# EAGLE schematic Franky (EAGLE 7.6.0)
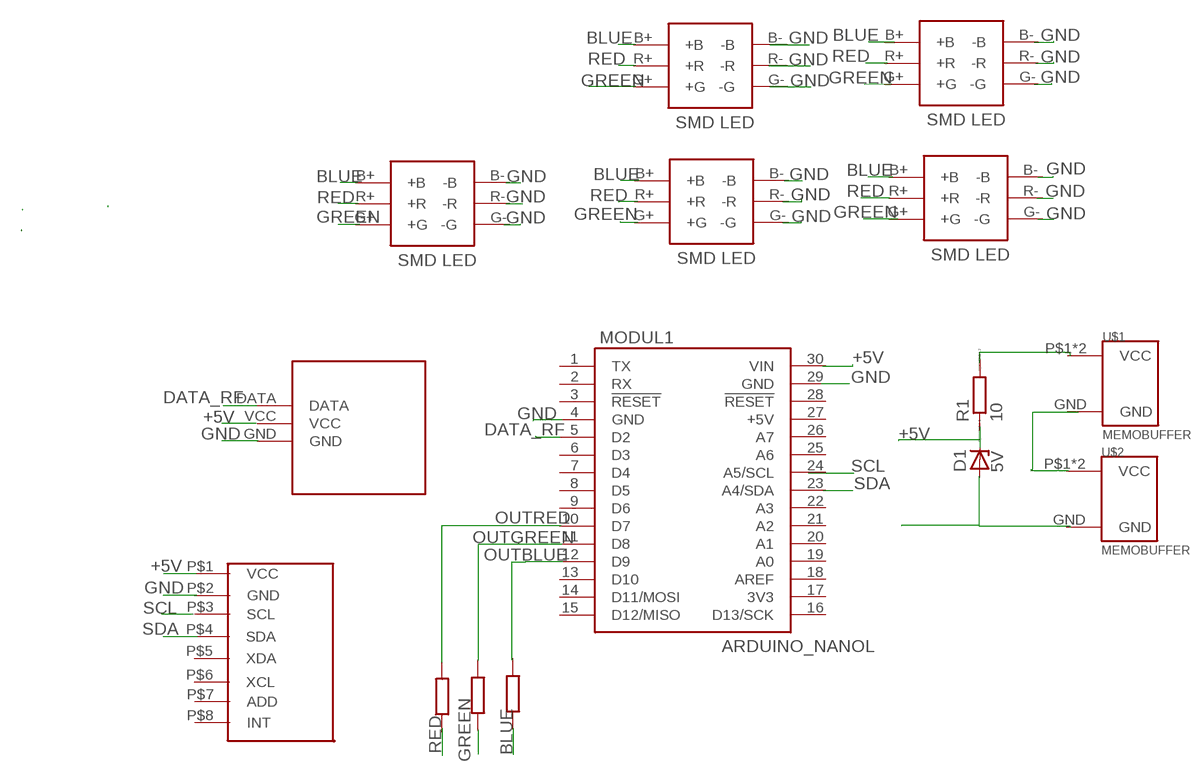
[diagram p0: schematic, sheet 1]

## Parts
D1  5V  1N4728  [DO41Z10]
GSENSOR  MPU-6050  [MPU-6050]
LED1  SMD_LED  [SMD_LED]
LED2  SMD_LED  [SMD_LED]
LED3  SMD_LED  [SMD_LED]
LED4  SMD_LED  [SMD_LED]
LED5  SMD_LED  [SMD_LED]
MODUL1  ARDUINO_NANOL  [ARDUINO_NANO_L]
R1  10  R  [R0805]
RFMODUL  AUKRU433_SENDER  [AUKRU433_SENDER]
U$1  MEMOBUFFER  [MEMOBUFFER]
U$2  MEMOBUFFER  [MEMOBUFFER]

## Nets
GND: LED3.B-(-B) LED3.G-(-G) LED3.R-(-R) LED4.B-(-B) LED4.G-(-G) LED4.R-(-R) LED5.B-(-B) LED5.G-(-G) LED5.R-(-R)
GREEN: LED3.G+(+G)
RED: LED3.R+(+R) LED4.R+(+R) LED5.R+(+R)
Unconnected: D1.A D1.C GSENSOR.P$1(VCC) GSENSOR.P$2(GND) GSENSOR.P$3(SCL) GSENSOR.P$4(SDA) GSENSOR.P$5(XDA) GSENSOR.P$6(XCL) GSENSOR.P$7(ADD) GSENSOR.P$8(INT) LED1.B+(+B) LED1.B-(-B) LED1.G+(+G) LED1.G-(-G) LED1.R+(+R) LED1.R-(-R) LED2.B+(+B) LED2.B-(-B) LED2.G+(+G) LED2.G-(-G) LED2.R+(+R) LED2.R-(-R) LED3.B+(+B) LED4.B+(+B) LED4.G+(+G) LED5.B+(+B) LED5.G+(+G) MODUL1.1(TX) MODUL1.2(RX) MODUL1.3(!RESET!) MODUL1.4(GND) MODUL1.5(D2) MODUL1.6(D3) MODUL1.7(D4) MODUL1.8(D5) MODUL1.9(D6) MODUL1.10(D7) MODUL1.11(D8) MODUL1.12(D9) MODUL1.13(D10) MODUL1.14(D11/MOSI) MODUL1.15(D12/MISO) MODUL1.16(D13/SCK) MODUL1.17(3V3) MODUL1.18(AREF) MODUL1.19(A0) MODUL1.20(A1) MODUL1.21(A2) MODUL1.22(A3) MODUL1.23(A4/SDA) MODUL1.24(A5/SCL) MODUL1.25(A6) MODUL1.26(A7) MODUL1.27(+5V) MODUL1.28(!RESET!) MODUL1.29(GND) MODUL1.30(VIN) R1.1 R1.2 RFMODUL.DATA RFMODUL.GND RFMODUL.VCC

## Power pins joined to a net without a drawn wire
GND: U$1.GND U$2.GND
VCC: U$1.P$1(VCC) U$1.VCC U$2.P$1(VCC) U$2.VCC

## Library data of the parts
D1 = diode:1N4728: Z DIODE 3.3 V, 1W, 5 percent
GSENSOR = MPU6050:MPU-6050
LED1-LED5 = SMD LEd:SMD_LED
MODUL1 = u6_arduino:ARDUINO_NANO
R1 = eagle-ltspice:R: RESISTOR, European symbol; SPICEMODEL: NONE; SPICEPREFIX: R
RFMODUL = Aukru433_Sender:AUKRU433_SENDER
U$1 U$2 = Memobuffer:MEMOBUFFER